# Altium schematic sheet FOC_DRIVER.SchDoc
size A2
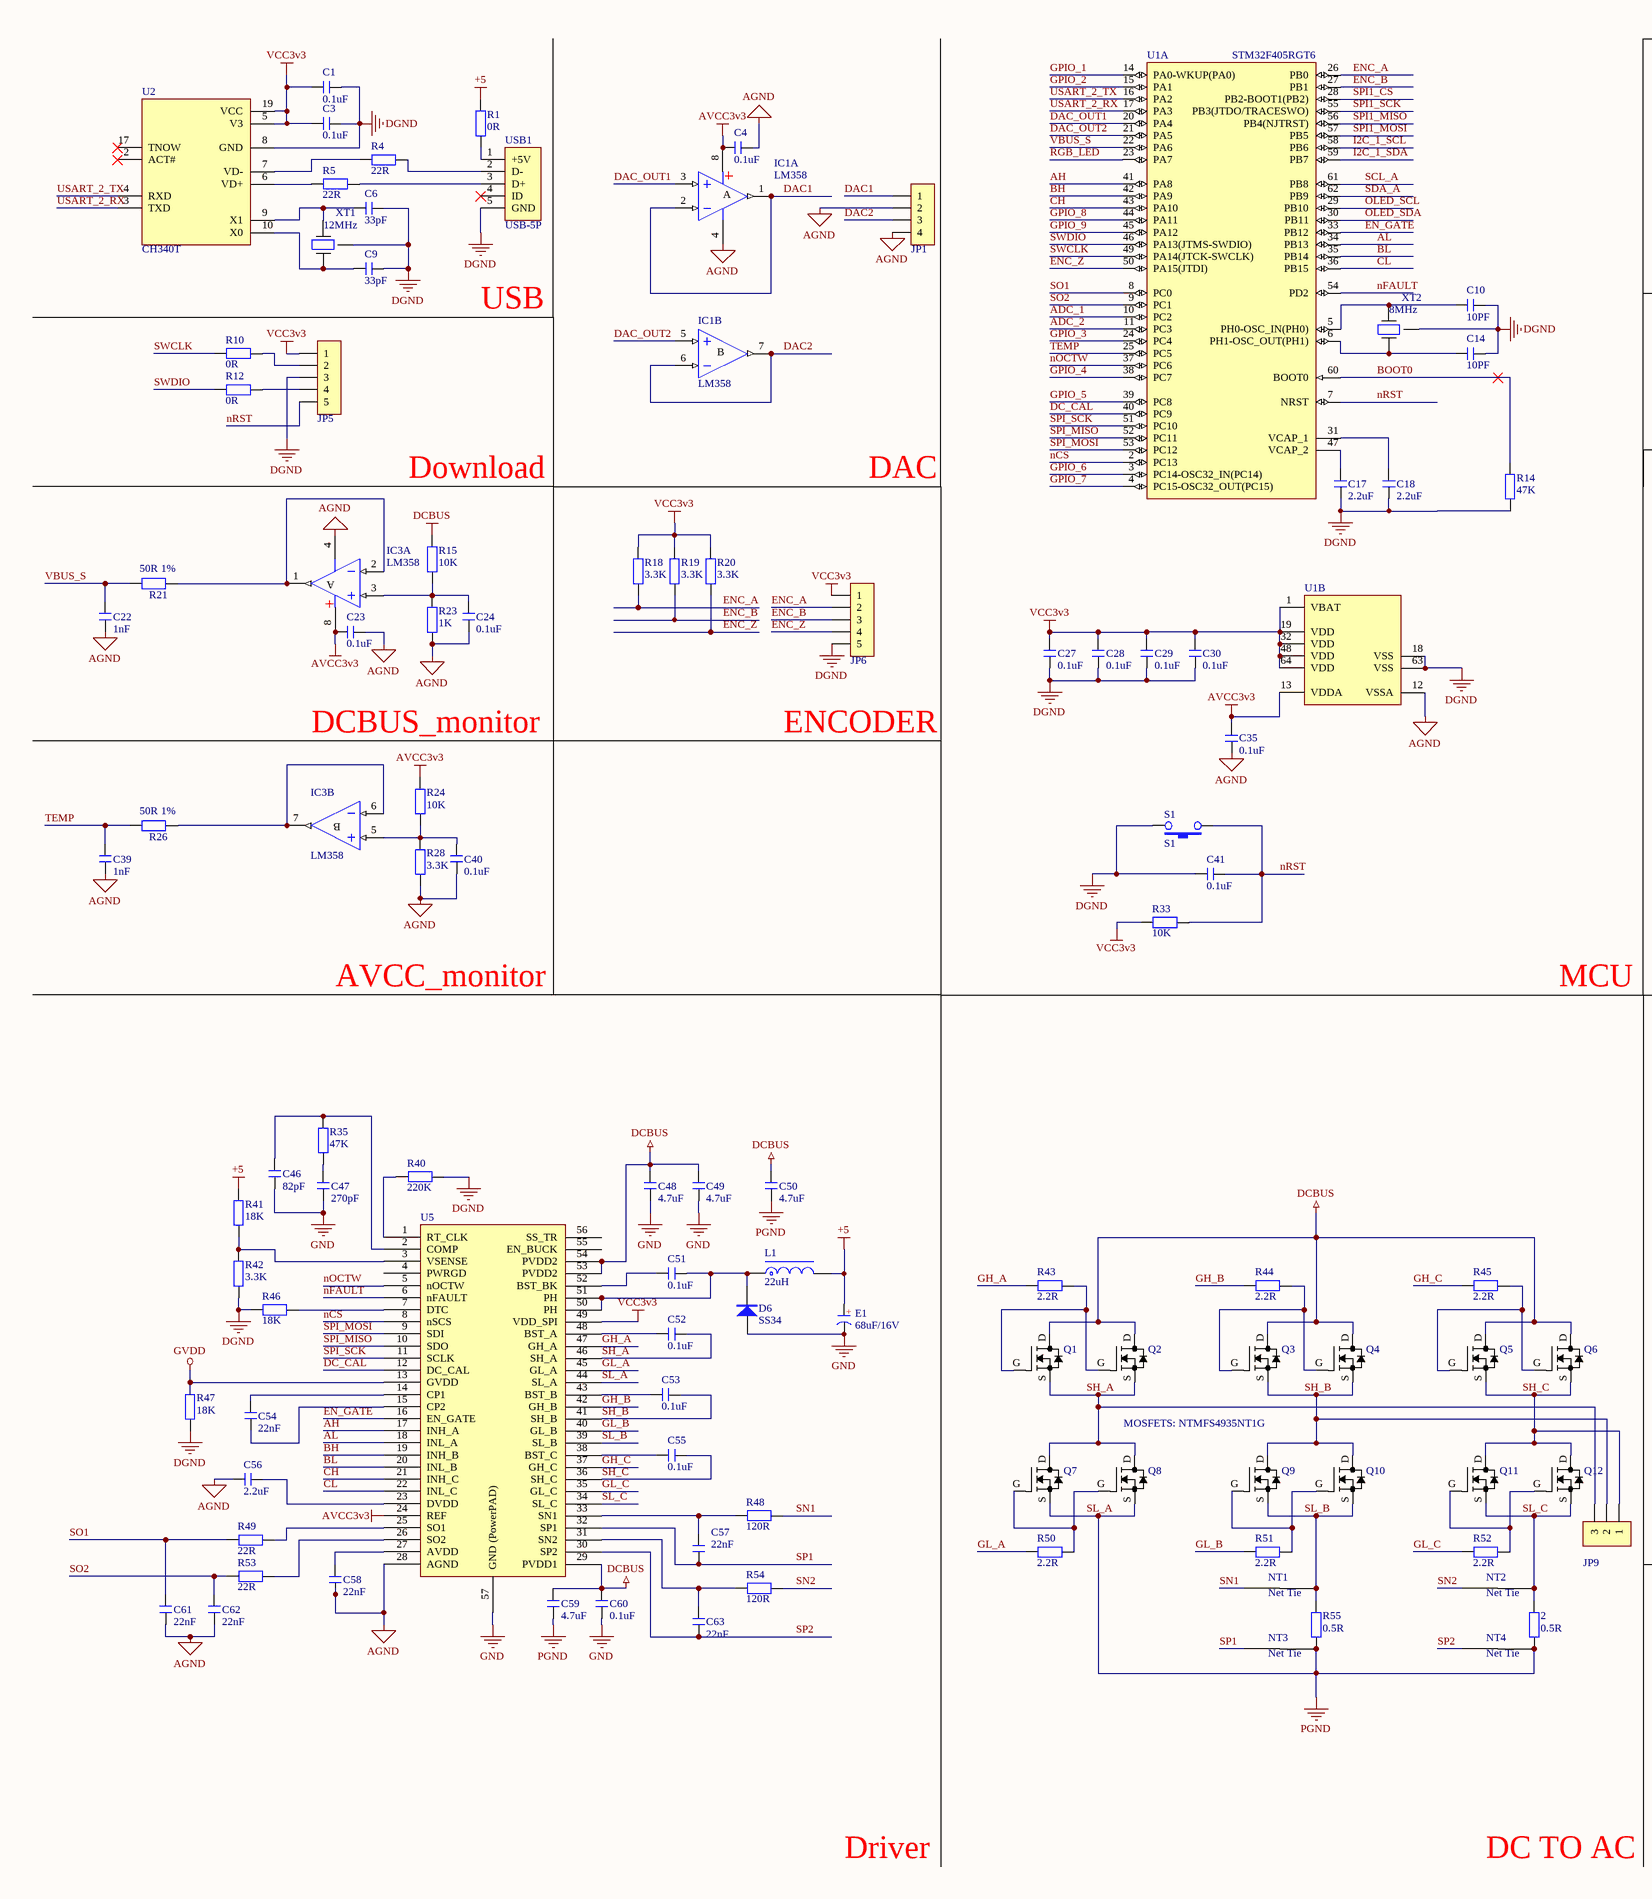
[diagram p0: FOC_DRIVER.SchDoc, left]
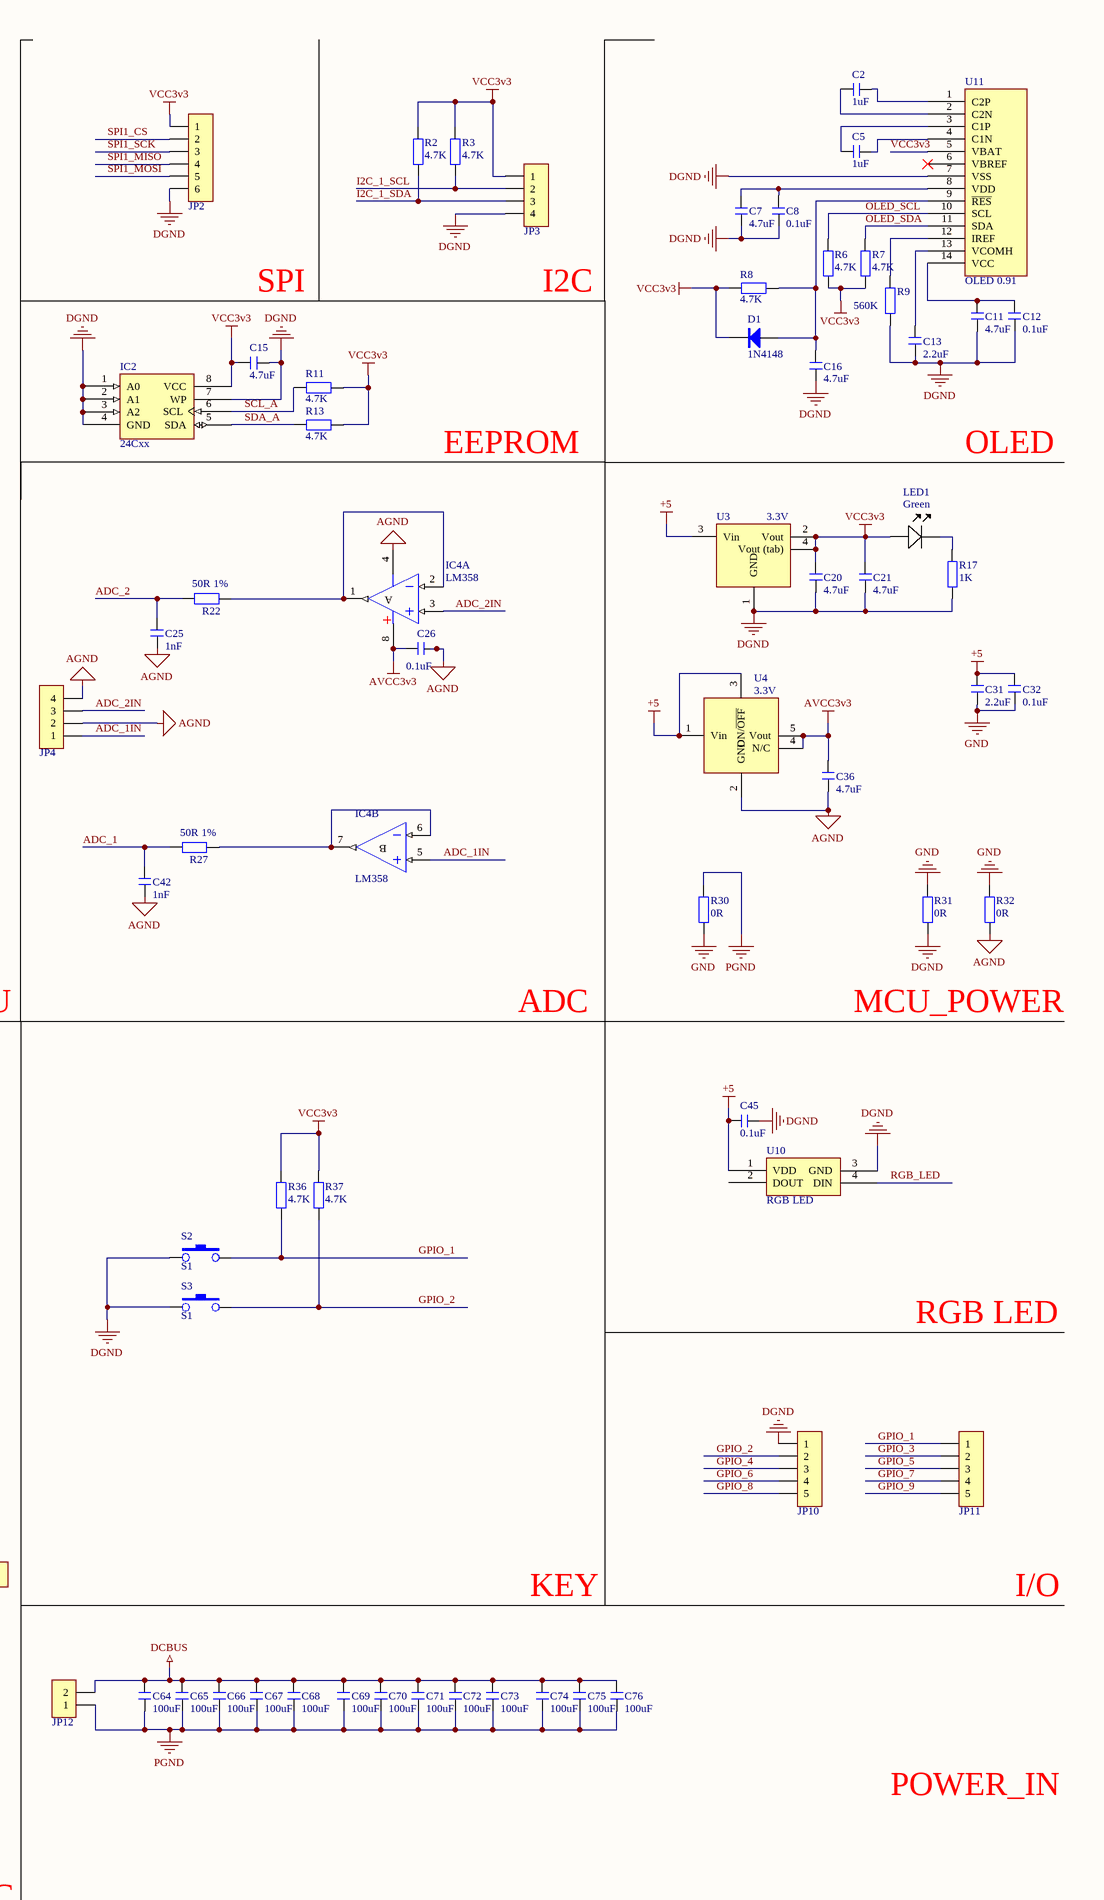
[diagram p1: FOC_DRIVER.SchDoc, right]

## Parts
2  0.5R  [R 2512_L]
C1  0.1uF  [C 0402_L]
C2  1uF  [C 0402_L]
C3  0.1uF  [C 0402_L]
C4  0.1uF  [C 0402_L]
C5  1uF  [C 0402_L]
C6  33pF  [C 0402_L]
C7  4.7uF  [C 0402_L]
C8  0.1uF  [C 0402_L]
C9  33pF  [C 0402_L]
C10  10PF  [C 0402_L]
C11  4.7uF  [C 0402_L]
C12  0.1uF  [C 0402_L]
C13  2.2uF  [C 0402_L]
C14  10PF  [C 0402_L]
C15  4.7uF  [C 0402_L]
C16  4.7uF  [C 0402_L]
C17  2.2uF  [C 0402_L]
C18  2.2uF  [C 0402_L]
C20  4.7uF  [C 0402_L]
C21  4.7uF  [C 0402_L]
C22  1nF  [C 0402_L]
C23  0.1uF  [C 0402_L]
C24  0.1uF  [C 0402_L]
C25  1nF  [C 0402_L]
C26  0.1uF  [C 0402_L]
C27  0.1uF  [C 0402_L]
C28  0.1uF  [C 0402_L]
C29  0.1uF  [C 0402_L]
C30  0.1uF  [C 0402_L]
C31  2.2uF  [C 0402_L]
C32  0.1uF  [C 0402_L]
C35  0.1uF  [C 0402_L]
C36  4.7uF  [C 0402_L]
C39  1nF  [C 0402_L]
C40  0.1uF  [C 0402_L]
C41  0.1uF  [C 0402_L]
C42  1nF  [C 0402_L]
C45  0.1uF  [C 0402_L]
C46  82pF  [C 0402_L]
C47  270pF  [C 0402_L]
C48  4.7uF  [C 0402_L]
C49  4.7uF  [C 0402_L]
C50  4.7uF  [C 0402_L]
C51  0.1uF  [C 0402_L]
C52  0.1uF  [C 0402_L]
C53  0.1uF  [C 0402_L]
C54  22nF  [C 0402_L]
C55  0.1uF  [C 0402_L]
C56  2.2uF  [C 0402_L]
C57  22nF  [C 0402_L]
C58  22nF  [C 0402_L]
C59  4.7uF  [C 0402_L]
C60  0.1uF  [C 0402_L]
C61  22nF  [C 0402_L]
C62  22nF  [C 0402_L]
C63  22nF  [C 0402_L]
C64  100uF  [C 1210_L]
C65  100uF  [C 1210_L]
C66  100uF  [C 1210_L]
C67  100uF  [C 1210_L]
C68  100uF  [C 1210_L]
C69  100uF  [C 1210_L]
C70  100uF  [C 1210_L]
C71  100uF  [C 1210_L]
C72  100uF  [C 1210_L]
C73  100uF  [C 1210_L]
C74  100uF  [C 1210_L]
C75  100uF  [C 1210_L]
C76  100uF  [C 1210_L]
D1  1N4148  [SOD-323]
D6  SS34  [DO214_SMA]
E1  68uF/16V  [CD C(6032)]
IC1  LM358  [SOP8_N]  (parts A,B of 2)
IC2  24Cxx  [SOP8_L]
IC3  LM358  [SOP8_N]  (parts A,B of 2)
IC4  LM358  [SOP8_N]  (parts A,B of 2)
JP1  HDR-1X4  [MX 1.25-WS-4P]  (value not drawn)
JP2  HDR-1X6  [MX 1.25-WS-6P]  (value not drawn)
JP3  HDR-1X4  [MX 1.25-WS-4P]  (value not drawn)
JP4  HDR-1X4  [MX 1.25-WS-4P]  (value not drawn)
JP5  HDR-1X5  [HDR2.54-WS-5P]  (value not drawn)
JP6  HDR-1X5  [HDR2.54-WS-5P]  (value not drawn)
JP9  HDR-1X3  [KF128-5.08-3P]  (value not drawn)
JP10  HDR-1X5  [HDR2.54-WS-5P]  (value not drawn)
JP11  HDR-1X5  [HDR2.54-WS-5P]  (value not drawn)
JP12  HDR-1X2  [KF128-5.08-2P]  (value not drawn)
L1  22uH  [CD42]
LED1  Green  [LED-0603-GREEN]
NT1  0.25mm  [NetTie_0.25mm]  (value not drawn)  (net tie, no BOM)
NT2  0.25mm  [NetTie_0.25mm]  (value not drawn)  (net tie, no BOM)
NT3  0.25mm  [NetTie_0.25mm]  (value not drawn)  (net tie, no BOM)
NT4  0.25mm  [NetTie_0.25mm]  (value not drawn)  (net tie, no BOM)
Q1  (no value)  [SO8FL]
Q2  FILL_FOOTPRINT  [SO8FL]  (value not drawn)
Q3  (no value)  [SO8FL]
Q4  FILL_FOOTPRINT  [SO8FL]  (value not drawn)
Q5  (no value)  [SO8FL]
Q6  FILL_FOOTPRINT  [SO8FL]  (value not drawn)
Q7  (no value)  [SO8FL]
Q8  (no value)  [SO8FL]
Q9  (no value)  [SO8FL]
Q10  (no value)  [SO8FL]
Q11  (no value)  [SO8FL]
Q12  (no value)  [SO8FL]
R1  0R  [R 0402_L]
R2  4.7K  [R 0402_L]
R3  4.7K  [R 0402_L]
R4  22R  [R 0402_L]
R5  22R  [R 0402_L]
R6  4.7K  [R 0402_L]
R7  4.7K  [R 0402_L]
R8  4.7K  [R 0402_L]
R9  560K  [R 0402_L]
R10  0R  [R 0402_L]
R11  4.7K  [R 0402_L]
R12  0R  [R 0402_L]
R13  4.7K  [R 0402_L]
R14  47K  [R 0402_L]
R15  10K  [R 0402_L]
R17  1K  [R 0402_L]
R18  3.3K  [R 0402_L]
R19  3.3K  [R 0402_L]
R20  3.3K  [R 0402_L]
R21  50R 1%  [R 0402_L]
R22  50R 1%  [R 0402_L]
R23  1K  [R 0402_L]
R24  10K  [R 0402_L]
R26  50R 1%  [R 0402_L]
R27  50R 1%  [R 0402_L]
R28  3.3K  [R 0402_L]
R30  0R  [R 0603_L]
R31  0R  [R 0603_L]
R32  0R  [R 0603_L]
R33  10K  [R 0402_L]
R35  47K  [R 0402_L]
R36  4.7K  [R 0402_L]
R37  4.7K  [R 0402_L]
R40  220K  [R 0402_L]
R41  18K  [R 0402_L]
R42  3.3K  [R 0402_L]
R43  2.2R  [R 0402_L]
R44  2.2R  [R 0402_L]
R45  2.2R  [R 0402_L]
R46  18K  [R 0402_L]
R47  18K  [R 0402_L]
R48  120R  [R 0402_L]
R49  22R  [R 0402_L]
R50  2.2R  [R 0402_L]
R51  2.2R  [R 0402_L]
R52  2.2R  [R 0402_L]
R53  22R  [R 0402_L]
R54  120R  [R 0402_L]
R55  0.5R  [R 2512_L]
S1  S1  [SW-SMD_TS-1066B-B3D2]
S2  S1  [SW-SMD_TS-1066B-B3D2]
S3  S1  [SW-SMD_TS-1066B-B3D2]
U1  (no value)  [STM-LQFP64_N]  (parts A,B of 2)
U2  CH340T  [CH340T]
U3  3.3V  [SOT223]
U4  3.3V  [SOT23-5]
U5  (no value)  [TSSOP50P810X120_HS-57N]
U10  RGB LED  [LED 3528-4Pin]
U11  OLED 0.91  [OLED-SMD_QG-2832XXX]
USB1  USB-5P  [USB-MINI-A]
XT1  value 12MHz  [OSC 3225-4P]  (hidden comment: 8 MHz)
XT2  value 8MHz  [OSC 3225-4P]  (hidden comment: 8 MHz)

## Nets
+5: C31.1 C32.1 C45.1 E1.1(A) L1.2 R1.2 R41.1 U3.3(Vin) U4.1(Vin) U4.3(ON/~{OFF}) U10.1(VDD)
AGND: C4.1 C22.2 C23.1 C24.2 C25.2 C26.1 C35.1 C36.2 C39.2 C40.2 C42.2 C56.1 C58.1 C61.2 C62.2 IC1.4(V-) IC3.4(V-) IC4.4(V-) JP1.2 JP1.4 JP4.2 JP4.4 R23.1 R28.1 R32.2 U1.12(VSSA) U4.2(GND) U5.28(AGND)
AVCC3v3: C4.2 C23.2 C26.2 C35.2 C36.1 IC1.8(V+) IC3.8(V+) IC4.8(V+) R24.2 U1.13(VDDA) U4.4(N/C) U4.5(Vout) U5.24(REF)
DCBUS: C48.1 C49.1 C50.1 C59.2 C60.2 C64.2 C65.2 C66.2 C67.2 C68.2 C69.2 C70.2 C71.2 C72.2 C73.2 C74.2 C75.2 C76.2 JP12.2 Q1.D Q2.D Q3.D Q4.D Q5.D Q6.D R15.2 U5.29(PVDD1) U5.53(PVDD2) U5.54(PVDD2)
DGND: C1.2 C3.2 C6.2 C7.1 C8.1 C9.2 C10.1 C11.2 C12.2 C13.2 C14.1 C15.2 C16.2 C17.1 C18.1 C20.2 C21.2 C27.1 C28.1 C29.1 C30.1 C41.1 C45.2 IC2.1(A0) IC2.2(A1) IC2.3(A2) IC2.4(GND) IC2.7(WP) JP2.6 JP3.4 JP5.3 JP6.5 JP10.1 R9.1 R14.1 R17.2 R31.2 R40.1 R42.2 R46.1 R47.2 S1.2 S2.1 S3.1 U1.18(VSS) U1.63(VSS) U2.8(GND) U3.1(GND) U10.3(GND) U11.7(VSS) USB1.5(GND) XT1.G XT2.G
GND: C31.2 C32.2 C46.2 C47.2 C48.2 C49.2 C60.1 D6.1(A) E1.2(K) R30.2 R31.1 R32.1 U5.57(GND_(PowerPAD))
GVDD: R47.1 U5.13(GVDD)
SL_A: 2.1 C50.2 C59.1 C64.1 C65.1 C66.1 C67.1 C68.1 C69.1 C70.1 C71.1 C72.1 C73.1 C74.1 C75.1 C76.1 JP12.1 NT3.2 NT4.2 Q7.S Q8.S R30.1 R55.1 U5.44(SL_A)  [also labelled PGND]
VCC3v3: C1.1 C3.1 C15.1 C20.1 C21.1 C27.2 C28.2 C29.2 C30.2 D1.2(K) IC2.8(VCC) JP2.1 JP3.1 JP5.1 JP6.1 LED1.A R2.2 R3.2 R6.1 R7.1 R8.1 R11.1 R13.1 R18.2 R19.2 R20.2 R33.1 R36.1 R37.1 U1.1(VBAT) U1.19(VDD) U1.32(VDD) U1.48(VDD) U1.64(VDD) U2.5(V3) U2.19(VCC) U3.2(Vout) U3.4(Vout_(tab)) U5.49(VDD_SPI) U11.5(VBAT)
ADC_1: C42.1 R27.2 U1.10(PC2)
ADC_1IN: IC4.5(IN+) JP4.1
ADC_2: C25.1 R22.2 U1.11(PC3)
ADC_2IN: IC4.3(IN+) JP4.3
AH: U1.41(PA8) U5.17(INH_A)
AL: U1.34(PB13) U5.18(INL_A)
BH: U1.42(PA9) U5.19(INH_B)
BL: U1.35(PB14) U5.20(INL_B)
BOOT0: R14.2 U1.60(BOOT0)
CH: U1.43(PA10) U5.21(INH_C)
CL: U1.36(PB15) U5.22(INL_C)
DAC1: IC1.1(OUT) IC1.2(IN-) JP1.1
DAC2: IC1.6(IN-) IC1.7(OUT) JP1.3
DAC_OUT1: IC1.3(IN+) U1.20(PA4)
DAC_OUT2: IC1.5(IN+) U1.21(PA5)
DC_CAL: U1.40(PC9) U5.12(DC_CAL)
EN_GATE: U1.33(PB12) U5.16(EN_GATE)
ENC_A: JP6.2 R18.1 U1.26(PB0)
ENC_B: JP6.3 R19.1 U1.27(PB1)
ENC_Z: JP6.4 R20.1 U1.50(PA15(JTDI))
GH_A: R43.1 U5.47(GH_A)
GH_B: R44.1 U5.42(GH_B)
GH_C: R45.1 U5.37(GH_C)
GL_A: R50.1 U5.45(GL_A)
GL_B: R51.1 U5.40(GL_B)
GL_C: R52.1 U5.35(GL_C)
GPIO_1: JP11.1 R36.2 S2.2 U1.14(PA0-WKUP(PA0))
GPIO_2: JP10.2 R37.2 S3.2 U1.15(PA1)
GPIO_3: JP11.2 U1.24(PC4)
GPIO_4: JP10.3 U1.38(PC7)
GPIO_5: JP11.3 U1.39(PC8)
GPIO_6: JP10.4 U1.3(PC14-OSC32_IN(PC14))
GPIO_7: JP11.4 U1.4(PC15-OSC32_OUT(PC15))
GPIO_8: JP10.5 U1.44(PA11)
GPIO_9: JP11.5 U1.45(PA12)
I2C_1_SCL: JP3.2 R3.1 U1.58(PB6)
I2C_1_SDA: JP3.3 R2.1 U1.59(PB7)
nCS: U1.2(PC13) U5.8(nSCS)
nFAULT: U1.54(PD2) U5.6(nFAULT)
nOCTW: U1.37(PC6) U5.5(nOCTW)
nRST: C41.2 JP5.5 R33.2 S1.1 U1.7(NRST)
OLED_SCL: R6.2 U1.29(PB10) U11.10(SCL)
OLED_SDA: R7.2 U1.30(PB11) U11.11(SDA)
RGB_LED: U1.23(PA7) U10.4(DIN)
SCL_A: IC2.6(SCL) R11.2 U1.61(PB8)
SDA_A: IC2.5(SDA) R13.2 U1.62(PB9)
SH_A: C52.2 JP9.3 Q1.S Q2.S Q7.D Q8.D U5.46(SH_A)
SH_B: C53.2 JP9.2 Q3.S Q4.S Q9.D Q10.D U5.41(SH_B)
SH_C: C55.2 JP9.1 Q5.S Q6.S Q11.D Q12.D U5.36(SH_C)
SL_B: NT1.2 Q9.S Q10.S R55.2 U5.39(SL_B)
SL_C: 2.2 NT2.2 Q11.S Q12.S U5.34(SL_C)
SN1: NT1.1 R48.2
SN2: NT2.1 R54.2
SO1: C61.1 R49.1 U1.8(PC0)
SO2: C62.1 R53.1 U1.9(PC1)
SP1: C57.2 NT3.1 U5.32(SP1)
SP2: C63.2 NT4.1 U5.30(SP2)
SPI1_CS: JP2.2 U1.28(PB2-BOOT1(PB2))
SPI1_MISO: JP2.4 U1.56(PB4(NJTRST))
SPI1_MOSI: JP2.5 U1.57(PB5)
SPI1_SCK: JP2.3 U1.55(PB3(JTDO/TRACESWO))
SPI_MISO: U1.52(PC11) U5.10(SDO)
SPI_MOSI: U1.53(PC12) U5.9(SDI)
SPI_SCK: U1.51(PC10) U5.11(SCLK)
SWCLK: R10.1 U1.49(PA14(JTCK-SWCLK))
SWDIO: R12.1 U1.46(PA13(JTMS-SWDIO))
TEMP: C39.1 R26.2 U1.25(PC5)
USART_2_RX: U1.17(PA3) U2.3(TXD)
USART_2_TX: U1.16(PA2) U2.4(RXD)
VBUS_S: C22.1 R21.2 U1.22(PA6)
NetC2_1: C2.1 U11.2(C2N)
NetC2_2: C2.2 U11.1(C2P)
NetC5_1: C5.1 U11.3(C1P)
NetC5_2: C5.2 U11.4(C1N)
NetC6_1: C6.1 U2.9(X1) XT1.3
NetC7_2: C7.2 C8.2 U11.8(VDD)
NetC9_1: C9.1 U2.10(X0) XT1.1
NetC10_2: C10.2 U1.5(PH0-OSC_IN(PH0)) XT2.3
NetC11_1: C11.1 C12.1 U11.14(VCC)
NetC13_1: C13.1 U11.13(VCOMH)
NetC14_2: C14.2 U1.6(PH1-OSC_OUT(PH1)) XT2.1
NetC16_1: C16.1 D1.1(A) R8.2 U11.9(~{RES})
NetC17_2: C17.2 U1.47(VCAP_2)
NetC18_2: C18.2 U1.31(VCAP_1)
NetC24_1: C24.1 IC3.3(IN+) R15.1 R23.2
NetC40_1: C40.1 IC3.5(IN+) R24.1 R28.2
NetC46_1: C46.1 R35.1 U5.2(COMP)
NetC47_1: C47.1 R35.2
NetC51_1: C51.1 U5.52(BST_BK)
NetC51_2: C51.2 D6.2(K) L1.1 U5.50(PH) U5.51(PH)
NetC52_1: C52.1 U5.48(BST_A)
NetC53_1: C53.1 U5.43(BST_B)
NetC54_1: C54.1 U5.14(CP1)
NetC54_2: C54.2 U5.15(CP2)
NetC55_1: C55.1 U5.38(BST_C)
NetC56_2: C56.2 U5.23(DVDD)
NetC57_1: C57.1 R48.1 U5.33(SN1)
NetC58_2: C58.2 U5.27(AVDD)
NetC63_1: C63.1 R54.1 U5.31(SN2)
NetIC3_1: IC3.1(OUT) IC3.2(IN-) R21.1
NetIC3_6: IC3.6(IN-) IC3.7(OUT) R26.1
NetIC4_1: IC4.1(OUT) IC4.2(IN-) R22.1
NetIC4_6: IC4.6(IN-) IC4.7(OUT) R27.1
NetJP5_2: JP5.2 R10.2
NetJP5_4: JP5.4 R12.2
NetLED1_K: LED1.K R17.1
NetQ1_G: Q1.G Q2.G R43.2
NetQ3_G: Q3.G Q4.G R44.2
NetQ5_G: Q5.G Q6.G R45.2
NetQ7_G: Q7.G Q8.G R50.2
NetQ9_G: Q9.G Q10.G R51.2
NetQ11_G: Q11.G Q12.G R52.2
NetR1_1: R1.1 USB1.1(+5V)
NetR4_1: R4.1 USB1.2(D-)
NetR4_2: R4.2 U2.7(VD-)
NetR5_1: R5.1 USB1.3(D+)
NetR5_2: R5.2 U2.6(VD+)
NetR9_2: R9.2 U11.12(IREF)
NetR40_2: R40.2 U5.1(RT_CLK)
NetR41_2: R41.2 R42.1 U5.3(VSENSE)
NetR46_2: R46.2 U5.7(DTC)
NetR49_2: R49.2 U5.25(SO1)
NetR53_2: R53.2 U5.26(SO2)

Not connected (* = marked no-connect by the designer): U2 2(ACT#)* 17(TNOW)*; U5 4(PWRGD) 55(EN_BUCK) 56(SS_TR); U10 2(DOUT); U11 6(VBREF)*; USB1 4(ID)*

## Notes on the sheet
- SPI
- I2C
- USB
- EEPROM
- OLED
- Download
- DAC
- DCBUS_monitor
- ENCODER
- AVCC_monitor
- MCU
- ADC
- MCU_POWER
- RGB LED
- MOSFETS: NTMFS4935NT1G
- KEY
- I/O
- POWER_IN
- Driver
- DC TO AC
- (in symbol C-CD) +
- (in symbol LM358, part A) A
- (in symbol LM358, part B) B
- (in symbol NetTie_0.25mm) Net Tie

## Library data of the parts
2 R1-R15 R17-R24 R26-R28 R30-R33 R35-R37 R40-R55 = R: 贴片电阻; 版权归属: 源创客; BOM名称: 贴片电阻; 学习资源: www.ooocke.com
C1-C18 C20-C32 C35 C36 C39-C42 C45-C76 = C: 无极性贴片电容; 版权归属: 源创客; BOM名称: 无极性贴片电容; 学习资源: www.ooocke.com
D1 = 1N4148: 高速开关二极管; 版权归属: 源创客; BOM名称: 高速开关二极管; 学习资源: www.ooocke.com
D6 = SS34: 肖特基二极管; 版权归属: 源创客; 属性: 40V/3A; BOM名称: 肖特基二极管; 学习资源: www.ooocke.com
E1 = C-CD: 贴片钽电容; 版权归属: 源创客; BOM名称: 贴片钽电容; 学习资源: www.ooocke.com
IC1 IC3 IC4 = LM358: 双路运放; 版权归属: 源创客; BOM名称: 双路运放; 学习资源: www.ooocke.com
IC2 = 24Cxx: 外置EEPROM; 版权归属: 源创客; BOM名称: 外置EEPROM; 学习资源: www.ooocke.com
JP1 JP3 JP4 = Header 4: 4P接插件; 版权归属: 源创客; BOM名称: 4P接插件; 学习资源: www.ooocke.com
JP2 = Header 6: 6P接插件; 版权归属: 源创客; BOM名称: 6P接插件; 学习资源: www.ooocke.com
JP5 JP6 JP10 JP11 = Header 5: 5P接插件; 版权归属: 源创客; BOM名称: 5P接插件; 学习资源: www.ooocke.com
JP9 = Header 3: 3P接插件; 版权归属: 源创客; BOM名称: 3P接插件; 学习资源: www.ooocke.com
JP12 = Header 2: 2P接插件; 版权归属: 源创客; BOM名称: 2P接插件; 学习资源: www.ooocke.com
L1 = L-CD: 贴片功率电感; BOM名称: 功率电感; 版权归属: 源创客; 学习资源: www.ooocke.com
LED1 = LTST-C190KGKT: LED GREEN CLEAR 0603 SMD; Manufacturer: Lite-On Inc.; Lens Color: Colorless; Millicandela Rating: 35mcd; Lens Style/Size: Rectangle with Flat Top, 1.10mm x 0.80mm; Voltage - Forward (Vf) (Typ): 2V; Current - Test: 20mA; Viewing Angle: 130°; Wavelength - Dominant: 571nm; Wavelength - Peak: 574nm; Supplier 1: Digi-Key; Supplier Part Number 1: 160-1435-1-ND; RoHS: RoHS Compliant; Category: Optoelectronics; Stock: 922756; Pricing 1: 1=0.27, 10=0.196, 25=0.1448, 100=0.1034, 250=0.07032, 500=0.06204, 1000=0.0486 (USD); Packaging: Cut Tape (CT); Part Status: Active; Color: Green; Lens Transparency: Clear; Mounting Type: Surface Mount; Features: -; Package / Case: 0603 (1608 Metric); Size / Dimension: 1.60mm L x 0.80mm W; Height (Max): 0.80mm; ComponentLink1URL: http://optoelectronics.liteon.com/upload/download/DS22-2000-074/S_110_LTST-C190KGKT.pdf; ComponentLink1Description: http://optoelectronics.liteon.com/upload/download/DS22-2000-074/S_110_LTST-C190KGKT.pdf; Manufacturer Part Number: LTST-C190KGKT
NT1-NT4 = NetTie_0.25mm
Q1-Q12 = NTMFS4935NT1G: MOSFET N-CH 30V 13A SO8FL; Manufacturer: ON Semiconductor; FET Type: N-Channel; Current - Continuous Drain (Id) @ 25°C: 13A (Ta), 93A (Tc); Drive Voltage (Max Rds On,  Min Rds On): 4.5V, 10V; Vgs(th) (Max) @ Id: 2.2V @ 250µA; Gate Charge (Qg) (Max) @ Vgs: 49.4nC @ 10V; Input Capacitance (Ciss) (Max) @ Vds: 4850pF @ 15V; Vgs (Max): ±20V; Power Dissipation (Max): 930mW (Ta), 48W (Tc); Rds On (Max) @ Id, Vgs: 3.2 mOhm @ 30A, 10V; Supplier 1: Digi-Key; Supplier Part Number 1: NTMFS4935NT1GOSCT-ND; RoHS: RoHS Compliant; Category: Discrete Semiconductor Products; Stock 1: 932; Pricing 1: 1=0.61, 10=0.541, 100=0.4145, 500=0.3277 (USD); Packaging: Cut Tape (CT); Part Status: Active; Technology: MOSFET (Metal Oxide); Drain to Source Voltage (Vdss): 30V; FET Feature: -; Operating Temperature: -55°C ~ 150°C (TJ); Mounting Type: Surface Mount; Supplier Device Package: 5-DFN (5x6) (8-SOFL); Package / Case: 8-PowerTDFN, 5 Leads; ComponentLink1URL: http://www.onsemi.com/pub_link/Collateral/NTMFS4935N-D.PDF; ComponentLink1Description: http://www.onsemi.com/pub_link/Collateral/NTMFS4935N-D.PDF; Manufacturer Part Number: NTMFS4935NT1G
S1-S3 = KEY_2P: 轻触按键2P
U1 = STM32F405RGT6: ARM Cortex-M4 32-bit MCU+FPU, 210 DMIPS, 1024 kB Flash, 192 kB Internal RAM, 51 I/Os, 64-pin LQFP, -40 to 85 degC, Tray; Manufacturer: STMicroelectronics; D/A Converter: 2x12-bit; FLASH Size (Prog) (kB): 1024; I/Os (High Current): 51; Internal RAM Size (kB): 192; Operating Frequency(F) (Processor speed) (MHz): 168; Supply Voltage(Vcc) max (V): 3.6; Supply Voltage(Vcc) min (V): 1.8; DatasheetVersion: Rev. 4; PackageVersion: Rev. 4, 06/2013; PackageReference: LQFP64; PackageDescription: 64-Pin Low Profile Quad Flat Package, 10 x 10 mm Body, 0.5 mm Pitch; Supplier 1: Digi-Key; Supplier Part Number 1: 497-11767-ND; Supplier 2: Farnell; Supplier Part Number 2: 2064363; Supplier 3: Newark; Supplier Part Number 3: 73T2329; Supplier 4: Mouser; Supplier Part Number 4: 511-STM32F405RGT6; Core: ARM Cortex-M4; Packing: Tray; Mounting Technology: Surface Mount; PartNumber: STM32F405RGT6; ComponentLink1Description: Manufacturer URL; ComponentLink1URL: http://www.st.com/web/en/home.html; ComponentLink2Description: Datasheet; ComponentLink2URL: http://www.st.com/st-web-ui/static/active/en/resource/technical/document/datasheet/DM00037051.pdf; ComponentLink3Description: Package Specification; ComponentLink3URL: http://www.st.com/st-web-ui/static/active/en/resource/technical/document/datasheet/DM00037051.pdf
U3 = AZ1117EH-3.3TRG1: IC REG LDO 3.3V 1A SOT223; Manufacturer: Diodes Incorporated; Regulator Topology: Positive Fixed; Voltage - Dropout (Typical): 1.1V @ 1A; Voltage - Input: Up to 13V; Supplier 1: Digi-Key; Supplier Part Number 1: AZ1117EH-3.3TRG1DICT-ND; RoHS: RoHS Compliant; Category: Integrated Circuits (ICs); Stock 1: 22748; Pricing 1: 1=0.43, 10=0.321, 100=0.1815, 500=0.12022, 1000=0.09216 (USD); Packaging: Cut Tape (CT); Part Status: Active; Voltage - Output: 3.3V; Current - Output: 1A; Current - Limit (Min): -; Operating Temperature: -40°C ~ 125°C; Mounting Type: Surface Mount; Package / Case: TO-261-4, TO-261AA; Supplier Device Package: SOT-223; ComponentLink1URL: http://www.diodes.com/assets/Datasheets/AZ1117E.pdf; ComponentLink1Description: http://www.diodes.com/assets/Datasheets/AZ1117E.pdf
U4 = LP5907MFX-3.3/NOPB: IC REG LDO 3.3V 0.25A SOT23-5; Manufacturer: Texas Instruments; Regulator Topology: Positive Fixed; Current - Output: 250mA; Voltage - Input: Up to 5.5V; Supplier 1: Digi-Key; Supplier Part Number 1: 296-38557-1-ND; RoHS: RoHS Compliant; Category: Integrated Circuits (ICs); Stock 1: 39845; Pricing 1: 1=0.57, 10=0.487, 100=0.3634, 500=0.28552, 1000=0.22063 (USD); Packaging: Cut Tape (CT); Part Status: Active; Voltage - Output: 3.3V; Voltage - Dropout (Typical): -; Current - Limit (Min): -; Operating Temperature: -40°C ~ 125°C; Mounting Type: Surface Mount; Package / Case: SC-74A, SOT-753; Supplier Device Package: SOT-23; ComponentLink1URL: http://www.ti.com/lit/ds/symlink/lp5907.pdf; ComponentLink1Description: http://www.ti.com/lit/ds/symlink/lp5907.pdf
U5 = DRV8301: MOTOR DRIVER, 3PH, 56HTSSOP
USB1 = USB-5P: 微型USB母座; 版权归属: 源创客; BOM名称: 微型USB母座; 学习资源: www.ooocke.com
XT1 = ABM3B-8.000MHZ-10-1-U-T: Crystal 8MHz ±10ppm 10pF 200 Ohm -10°C ~ 60°C Surface Mount 4-SMD, No Lead (DFN, LCC); pin to pad: G>2+4; Manufacturer: Abracon LLC; Operating Mode: Fundamental; Supplier 1: Digi-Key; Supplier Part Number 1: 535-9721-1-ND; RoHS: RoHS Compliant; Category: Crystals, Oscillators, Resonators; Stock: 35437; Pricing 1: 1=0.69, 10=0.578, 50=0.5198, 100=0.462, 500=0.4389 (USD); Packaging: Cut Tape (CT); Part Status: Active; Type: MHz Crystal; Frequency Stability: ±10ppm; Frequency Tolerance: ±10ppm; Load Capacitance: 10pF; Operating Temperature: -10°C ~ 60°C; Ratings: -; Mounting Type: Surface Mount; Package / Case: 4-SMD, No Lead; Size / Dimension: 0.197" L x 0.126" W (5.00mm x 3.20mm); Height - Seated (Max): 0.043" (1.10mm); ComponentLink1URL: http://www.abracon.com/Resonators/abm3b.pdf; ComponentLink1Description: http://www.abracon.com/Resonators/abm3b.pdf; Supplier 2: Digi-Key; Supplier Part Number 2: 535-9721-2-ND; Pricing 2: 1000=0.336, 3000=0.315, 5000=0.3045, 10000=0.294 (USD); Manufacturer Part Number: ABM3B-8.000MHZ-10-1-U-T
XT2 = ABM3B-8.000MHZ-10-1-U-T: Crystal 8MHz ±10ppm 10pF 200 Ohm -10°C ~ 60°C Surface Mount 4-SMD, No Lead (DFN, LCC); pin to pad: G>4+2; Manufacturer: Abracon LLC; Operating Mode: Fundamental; Supplier 1: Digi-Key; Supplier Part Number 1: 535-9721-1-ND; RoHS: RoHS Compliant; Category: Crystals, Oscillators, Resonators; Stock: 35437; Pricing 1: 1=0.69, 10=0.578, 50=0.5198, 100=0.462, 500=0.4389 (USD); Packaging: Cut Tape (CT); Part Status: Active; Type: MHz Crystal; Frequency Stability: ±10ppm; Frequency Tolerance: ±10ppm; Load Capacitance: 10pF; Operating Temperature: -10°C ~ 60°C; Ratings: -; Mounting Type: Surface Mount; Package / Case: 4-SMD, No Lead; Size / Dimension: 0.197" L x 0.126" W (5.00mm x 3.20mm); Height - Seated (Max): 0.043" (1.10mm); ComponentLink1URL: http://www.abracon.com/Resonators/abm3b.pdf; ComponentLink1Description: http://www.abracon.com/Resonators/abm3b.pdf; Supplier 2: Digi-Key; Supplier Part Number 2: 535-9721-2-ND; Pricing 2: 1000=0.336, 3000=0.315, 5000=0.3045, 10000=0.294 (USD); Manufacturer Part Number: ABM3B-8.000MHZ-10-1-U-T